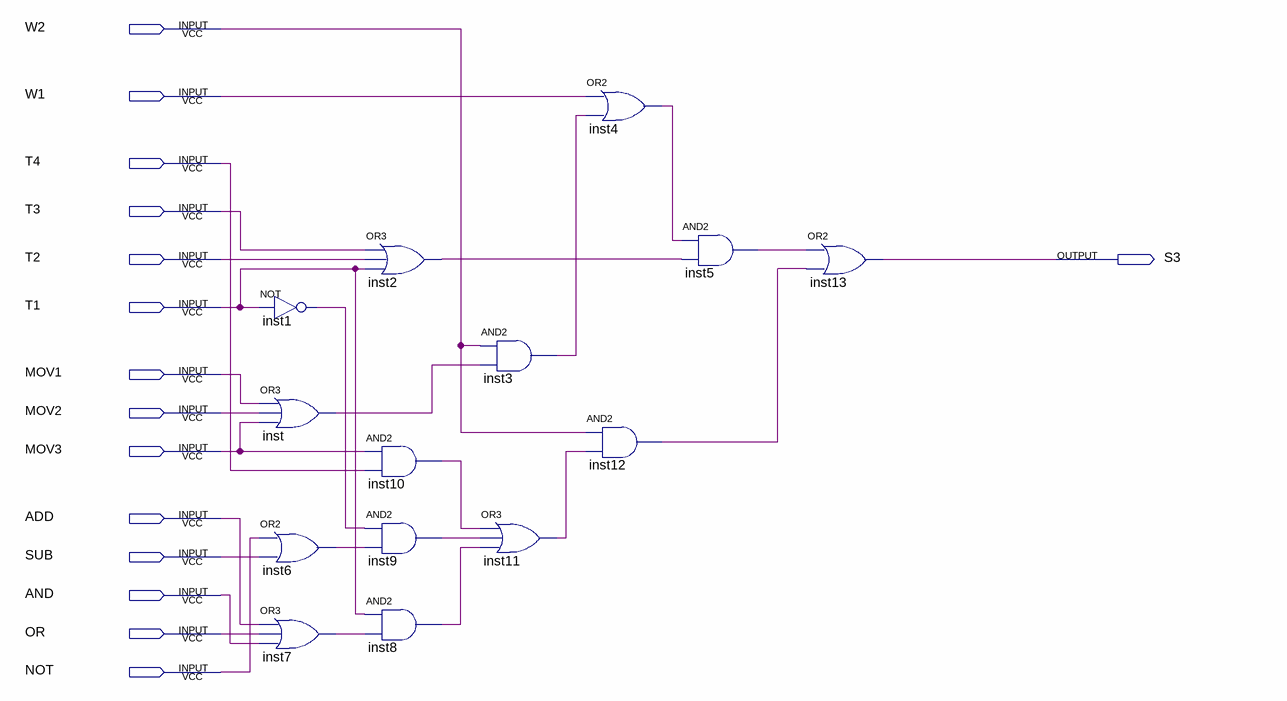
[diagram p0: schematic sheet]
// Quartus schematic S3.bdf as structural Verilog: 14 symbols, 15 pins
module S3 (
  input  W2,
  input  W1,
  input  T4,
  input  T3,
  input  T2,
  input  T1,
  input  MOV1,
  input  MOV2,
  input  MOV3,
  input  ADD,
  input  SUB,
  input  AND,
  input  OR,
  input  NOT,
  output S3
);

  wire inst1_out, inst2_out, inst3_out, inst4_out, inst5_out, inst6_out, inst7_out, inst8_out, inst9_out,
       inst10_out, inst11_out, inst12_out, inst_out;

  not inst1 (inst1_out, T1);
  or inst (inst_out, MOV1, MOV2, MOV3);
  or inst6 (inst6_out, NOT, SUB);
  or inst7 (inst7_out, ADD, OR, AND);
  or inst2 (inst2_out, T3, T2, T1);
  and inst10 (inst10_out, MOV3, T4);
  and inst9 (inst9_out, inst1_out, inst6_out);
  and inst8 (inst8_out, T1, inst7_out);
  and inst3 (inst3_out, W2, inst_out);
  or inst11 (inst11_out, inst10_out, inst9_out, inst8_out);
  or inst4 (inst4_out, W1, inst3_out);
  and inst12 (inst12_out, W2, inst11_out);
  and inst5 (inst5_out, inst4_out, inst2_out);
  or inst13 (S3, inst5_out, inst12_out);
endmodule
